# EAGLE schematic 電源基盤 (EAGLE 9.6.2)
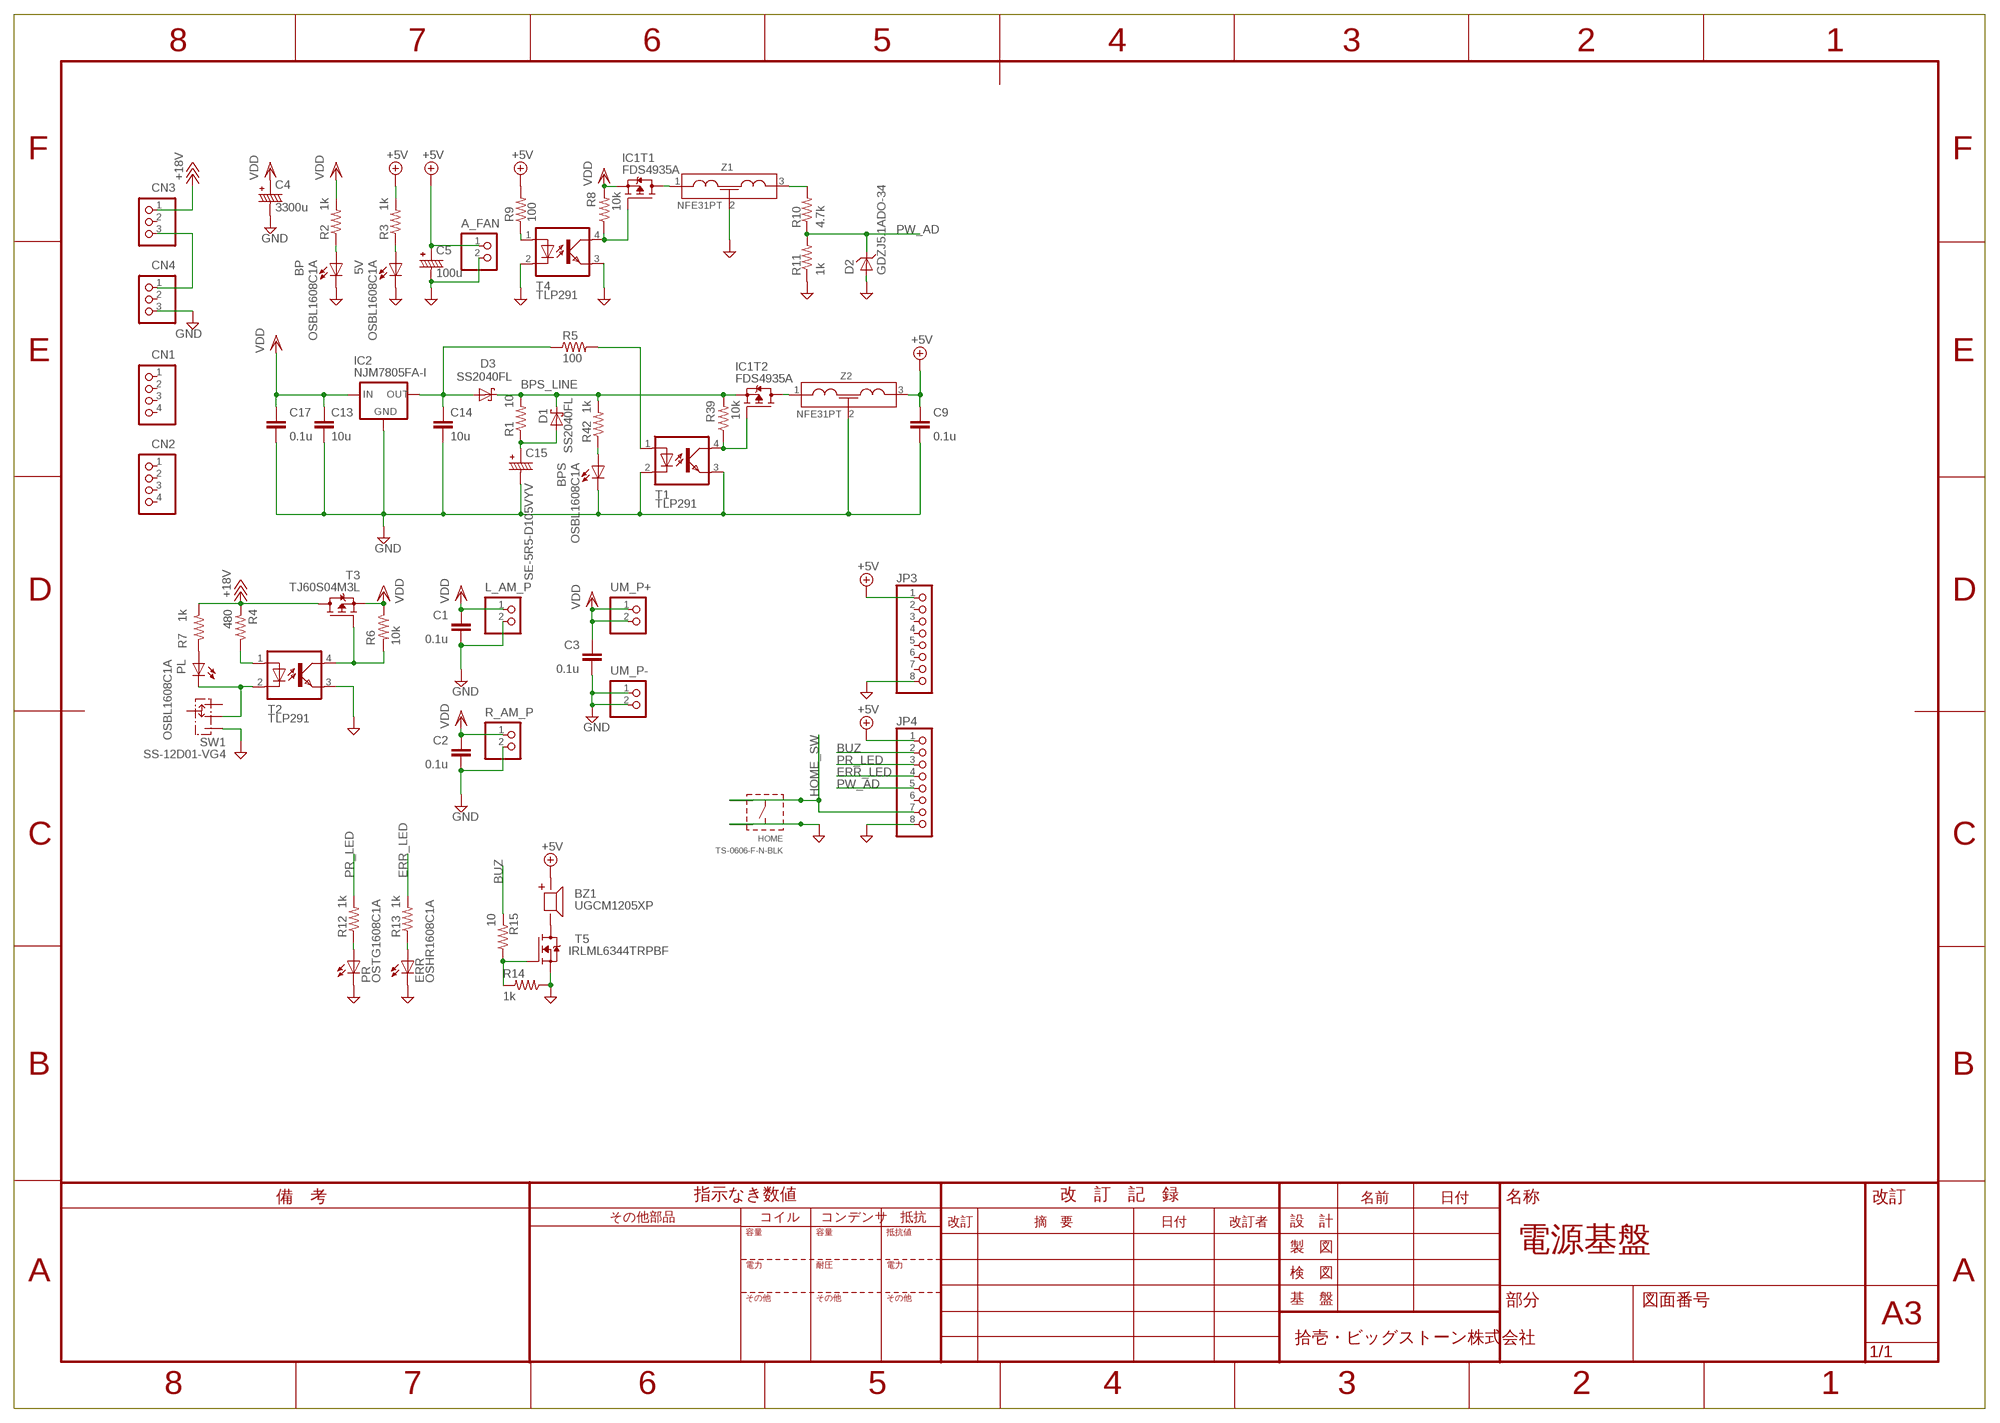
[diagram p0: schematic, sheet 1]

## Parts
5V  OSBL1608C1A  [LEDC1608X39N_B]
A_FAN  B2B-XH-A  [B2B-XH-A]
BP  OSBL1608C1A  [LEDC1608X39N_B]
BPS  OSBL1608C1A  [LEDC1608X39N_B]
BZ1  UGCM1205XP  [UGCM1205XP]
C1  0.1u  C-EUC0603  [C0603]
C2  0.1u  C-EUC0603  [C0603]
C3  0.1u  C-EUC0603  [C0603]
C4  3300u  35WXA3300MEFC18X25  [D18_L25_P7.5_D1]
C5  100u  16MH7100MEFC6.3X7  [CPOL6.3-7_2.5]
C9  0.1u  C-EUC0603  [C0603]
C13  10u  C2012  [C0805]
C14  10u  C2012  [C0805]
C15  SE-5R5-D105VYV  [SE-5R5-D105VYV]
C17  0.1u  C-EUC0603  [C0603]
CN1  B4B-XH-A  [B4B-XH-A]
CN2  B4B-XH-A  [B4B-XH-A]
CN3  B3P-VH  [B3P-VH]
CN4  B3P-VH  [B3P-VH]
D1  SS2040FL  [SOD-123]
D2  GDZJ5.1ADO-34  [DIOAD590W50L290D210B]
D3  SS2040FL  [SOD-123]
ERR  OSHR1608C1A  [LEDC1608X39N_R]
HOME  TS-0606-F-N-BLK  [TS-0606-F-N]
IC1  FDS4935A  [SOIC127P600X250-8N]
IC2  NJM7805FA-I  [TO220]
JP3  PINHD-1X8  [1X08]
JP4  PINHD-1X8  [1X08]
L_AM_P  B2P-VH  [B2P-VH]
PL  OSBL1608C1A  [LEDC1608X39N_B]
PR  OSTG1608C1A  [LEDC1608X39N_G]
R1  10  R-US_R0603  [R0603]
R2  1k  R-US_R0603  [R0603]
R3  1k  R-US_R0603  [R0603]
R4  480  R-US_R0603  [R0603]
R5  100  R-US_R0603  [R0603]
R6  10k  R-US_R0603  [R0603]
R7  1k  R-US_R0603  [R0603]
R8  10k  R-US_R0603  [R0603]
R9  100  R-US_R0603  [R0603]
R10  4.7k  R-US_R0603  [R0603]
R11  1k  R-US_R0603  [R0603]
R12  1k  R-US_R0603  [R0603]
R13  1k  R-US_R0603  [R0603]
R14  1k  R-US_R0603  [R0603]
R15  10  R-US_R0603  [R0603]
R39  10k  R-US_R0603  [R0603]
R42  1k  R-US_R0603  [R0603]
R_AM_P  B2P-VH  [B2P-VH]
SW1  SS-12D01-VG4  [SS-12D01-VG4]
T1  TLP291  [SOIC127P700X210-4N]
T2  TLP291  [SOIC127P700X210-4N]
T3  TJ60S04M3L  [DPACK]
T4  TLP291  [SOIC127P700X210-4N]
T5  IRLML6344TRPBF  [SOT95P240X110-3N]
UM_P+  B2P-VH  [B2P-VH]
UM_P-  B2P-VH  [B2P-VH]
Z1  NFE31PT  [NFE31]
Z2  NFE31PT  [NFE31]

## Nets
5V1 [power]: IC1.7(T2:D) IC1.8(T2:D) Z2.1
+5V: A_FAN.1 BZ1.+ C5.+ C9.1 JP3.1 JP4.1 R3.2 R9.2 Z2.3
+18V [power]: CN3.1 R4.2 R7.2 T3.2(D)
BLINE2 [power]: CN3.3 CN4.1
BPS_LINE [power]: D1.1(C) D3.1(C) IC1.1(T2:S) R1.2 R39.2 R42.2
BPS_OR [power]: C15.+ D1.2(A) R1.1
BUZ: JP4.2 R15.2
ERR_LED: JP4.3 R13.2
GND: 5V.2(C) A_FAN.2 BP.2(C) BPS.2(C) C1.2 C2.2 C3.2 C4.- C5.- C9.2 C13.2 C14.2 C15.- C17.2 CN4.3 D2.2(A) ERR.2(C) HOME.T3 HOME.T4 IC2.2(GND) JP3.8 JP4.8 L_AM_P.2 PR.K(C) R11.1 R14.1 R_AM_P.2 SW1.NO T1.2(C) T1.3(EMIT) T2.3(EMIT) T4.2(C) T4.3(EMIT) T5.2(S) UM_P-.1 UM_P-.2 Z1.2 Z2.2
HOME_SW: HOME.T1 HOME.T2 JP4.7
N$1: PL.1(A) R7.1
N$2: BP.1(A) R2.1
N$3: 5V.1(A) R3.1
N$4: IC1.5(T1:D) IC1.6(T1:D) Z1.1
N$5 [power]: C14.1 D3.2(A) IC2.3(OUT) R5.1
N$6: R4.1 T2.1(A)
N$7: PL.2(C) SW1.COM T2.2(C)
N$8: R6.2 T2.4(COL) T3.1(G)
N$9: IC1.4(T1:G) R8.1 T4.4(COL)
N$10: PR.A R12.1
N$11: R9.1 T4.1(A)
N$12: R10.2 Z1.3
N$13: IC1.2(T2:G) R39.1 T1.4(COL)
N$14: ERR.1(A) R13.1
N$15: BZ1.- T5.3(D)
N$16: R14.2 R15.1 T5.1(G)
N$17: R5.2 T1.1(A)
N$47: BPS.1(A) R42.1
PR_LED: JP4.4 R12.2
PW_AD: D2.1(C) JP4.5 R10.1 R11.2
VDD [power]: C1.1 C2.1 C3.1 C4.+ C13.1 C17.1 IC1.3(T1:S) IC2.1(IN) L_AM_P.1 R2.2 R6.1 R8.2 R_AM_P.1 T3.3(S) UM_P+.1 UM_P+.2
Unconnected: CN1.1 CN1.2 CN1.3 CN1.4 CN2.1 CN2.2 CN2.3 CN2.4 CN3.2 CN4.2 JP3.2 JP3.3 JP3.4 JP3.5 JP3.6 JP3.7 JP4.6 SW1.NC

## Library data of the parts
5V BP BPS PL = LED:OSBL1608C1A: 青色チップＬＥＤ ［１６０８］ ＯＳＢＬ１６０８ （２０個入） [OSBL1608C1A] 通販コード I-03982 発売日 2010/07/14 定格(Ta=25℃時) ◆VF：2.9V(IF=5mA) ◆最大電流：30mA ◆輝度1：23mcd(IF=5mA) ◆輝度2：70mcd(IF=20mA) ◆波長：470nm(青色) ◆サイズ：1608 (横1.6x縦0.8x厚さ0.6mm) ◆逆耐圧：5V ◆PD：100mW ■カラーバリエーション 白色I-03986 </catalog/g/gI-03986/> 赤色I-03978 </catalog/g/gI-03978/> 緑色I-06417 </catalog/g/gI-06417/> 青色I-03982 </catalog/g/gI-03982/> 黄色I-03984橙色I-06416 </catalog/g/gI-06416/> 黄緑色I-03980 </catalog/g/gI-03980/> ウォームホワイト色I-09640 </catalog/g/gI-09640> </catalog/g/gI-03984/> ◆販売単位：20個カットテーピング ※4000個単位のリール(I-03983 </catalog/g/gI-03983/>)もございます。 [I-03982] 青色チップＬＥＤ ［１６０８］ ＯＳＢＬ１６０８ （２０個入） </catalog/faq/faq.aspx#10020> 1パック ￥200（税込）
A_FAN = jst-xh:B2B-XH-A: Wire-to-Board 2.5mm pitch top mount connector Source: http://www.jst-mfg.com/product/pdf/jpn/XH.pdf http://www.jst-mfg.com/product/detail.php?series=277
BZ1 = UGCM1205XP:UGCM1205XP
C1-C3 C9 C17 = rcl:C-EU: CAPACITOR, European symbol; SPICEPREFIX: C
C4 = 小形アルミニウム電解コンデンサ_WXAシリーズ:35WXA3300MEFC18X25
C5 = 小形アルミニウム電解コンデンサ_MH7シリーズ:16MH7100MEFC6.3X7
C13 C14 = rcl:C: CAPACITOR, European symbol; SPICEPREFIX: C
C15 = スーパーキャパシタ:SE-5R5-D105VYV: 電気二重層コンデンサー１Ｆ５．５Ｖ（薄型） [SE-5R5-D105VYV] 通販コード P-04249 発売日 2010/11/21 メーカーカテゴリ KAMCAP </catalog/goods/search.aspx?maker=KAM&style=T&search.x=true> コイン型の電気二重層コンデンサです。 リアルタイムクロックのバックアップ電源等に最適です。 縦置き型(立型)ですので、基板の実装面積の縮小が可能です。 適度な内部抵抗を持ち、特別な回路なしで簡単に使えます。 耐圧が5V以上あり、一般的デジタル回路に簡単に使えま※極性は本体の端子の刻印で判別できます。 主な仕様 ・容量：1.0F(=1,000,000μF) ・容量誤差：+10%~+30% ・耐圧：5.5V ・最大等価直列抵抗(ESR)：10Ω(@1kHz) ・動作温度範囲：-25℃~70℃ 寸法 ・直径：18.5mm ・厚さ：4.0mm ・ピン間：約5.0mm [P-04249] 電気二重層コンデンサー１Ｆ５．５Ｖ（薄型） 1個 ￥100（税込）
CN1 CN2 = jst-xh:B4B-XH-A: Wire-to-Board 2.5mm pitch top mount connector Source: http://www.jst-mfg.com/product/pdf/jpn/XH.pdf http://www.jst-mfg.com/product/detail.php?series=277
CN3 CN4 = jst-vh:B3P-VH: Wire-to-Board 3.96mm pitch top mount connector Source: http://www.jst-mfg.com/product/pdf/jpn/VH.pdf http://www.jst-mfg.com/product/detail.php?series=262
D1 D3 = PI_ダイオード:SS2040FL: 表面実装用ショットキーバリアダイオード（４０Ｖ２Ａ）ＳＳ２０４０ＦＬ（２０個入） [SS2040FL] 通販コード I-02073 発売日 2007/10/24 メーカーカテゴリ PANJIT INTERNATIONAL INC.(パンジット) </catalog/goods/search.aspx?maker=panjit&style=T&search.x=true> 表面実装タイプのショットキー・バリア・ダイオードです。 ■主な仕様 ・種類：ショットキーバリア ・回路数：1 ・逆電圧：40V ・平均順電流：2.0A ・ピーク順電流：50A ・順電圧：0.45V ・端子間容量：70pF ・パッケージ：SOD-123FL 3000個単位(リール売り)は→I-02074 </catalog/g/gI-02074/> [I-02073] 表面実装用ショットキーバリアダイオード（４０Ｖ２Ａ）ＳＳ２０４０ＦＬ（２０個入） </catalog/faq/faq.aspx#10020> 1パック ￥300（税込）
D2 = ダイオード:GDZJ5.1A: ツェナーダイオード（５．１Ｖ５００ｍＷ） ＧＤＺＪ５．１Ａ [GDZJ5.1A] 通販コード I-07493 発売日 2014/03/12 メーカーカテゴリ PANJIT INTERNATIONAL INC.(パンジット) PANJIT社のツェナー(定電圧)ダイオードです。 ■主な仕様 ・種類：ツェナーダイオード ・回路数：1 ・許容損失：500mW ・ツェナー電圧：5.1V ・パッケージ：DO-34 GDZJシリーズ PDFデータシート 1本 ￥10（税込）
ERR = LED:OSHR1608C1A: 赤色チップＬＥＤ ［１６０８］ ＯＳＨＲ１６０８ （２０個入） [OSHR1608C1A] 通販コード I-03978 発売日 2010/07/14 メーカーカテゴリ OptoSupply </catalog/goods/search.aspx?maker=optosupp&style=T&search.x=true> 定格(Ta=25℃) ◆VF：1.9V(IF=5mA) ◆最大電流：30mA ◆輝度1：35mcd(IF=5mA) ◆輝度2：140mcd(IF=25mA) ◆最大消費電力：70mW ◆波長：625nm(赤色) ◆サイズ：1608 (横1.6x縦0.8厚0.4mm) ◆逆耐圧：5V ◆PD：70mW ■カラーバリエーション 白色I-03986 </catalog/g/gI-03986/> 赤色I-03978 </catalog/g/gI-03978/> 緑色I-06417 </catalog/g/gI-06417/> 青色I-03982 </catalog/g/gI-03982/> 黄色I-03984橙色I-06416 </catalog/g/gI-06416/> 黄緑色I-03980 </catalog/g/gI-03980/> ウォームホワイト色I-09640 </catalog/g/gI-09640> </catalog/g/gI-03984/> ※4000個単位のリール(I-03979 </catalog/g/gI-03979/>)もございます。 [I-03978] 赤色チップＬＥＤ ［１６０８］ ＯＳＨＲ１６０８ （２０個入） 1パック ￥200（税込）
HOME = タクトスイッチ:TS-0606-F-N-BLK: タクトスイッチ（黒色） [TS-0606-F-N-BLK] 通販コード P-03647 発売日 2010/04/01 メーカーカテゴリ Cosland Co,. Ltd. </catalog/goods/search.aspx?maker=cosland&style=T&search.x=true> 基板取付用のタクトスイッチ(押しボタンスイッチ)です。2.54mmピッチの基板に使用できます。 ※入荷時期により色あい、細かいデザインや形が微妙に変わることがあります、ご了承ください。 ■主な仕様 ・種別：タクトスイッチ ・表記：A接点 ・回路数：1回路 ・接点：1接点 ・定格印加電圧：30VDC ・定格開閉電圧：12VDC ・定格開閉電流：50mA ・定格通電電流：300mA ・定格開閉皮相電力：9W ・接触抵抗：100mΩ以下 ・動作：モーメンタリ ・取付タイプ：基板取付 ・電気的接続：スルーホール実装 ・色：黒 ・ピン数：4 TS-0606シリーズ PDFデータシート </download/ds/cosland/ts-0606_20200714.pdf> TS-0606シリーズ一覧 </catalog/goods/search.aspx?keyword=&maker=&goods=&number=TS-0606-F-N&name=&min_price=&max_price=&last_sdt=&sort=&style=T&search.x=0&search.y=0> ● この商品のよくある質問（Ｑ＆Ａ） </catalog/faq/goodsfaq.aspx?goods=P-03647>が1件あります。商品選定・製作の参考にしてください。 関連商品≫組立ｷｯﾄ </catalog/c/ckit_dT> / ﾌﾞﾚｯﾄﾞﾎﾞｰﾄﾞ </catalog/c/cbread> / ﾏｲｺﾝ </catalog/c/cmicon_dT>(PIC </catalog/c/cpicr> H8 </catalog/c/ch8> RX </catalog/c/crx>) / USB </catalog/c/cusb> / TR </catalog/c/ctr>(TO-220 </catalog/c/cto-220> TO-92 </catalog/c/cto-92> TO-3P </catalog/c/cto-3p> SMD </catalog/c/cctr>) / FET </catalog/c/cfet>(Nch </catalog/c/c2sk> Pch </catalog/c/c2sj> SMD </catalog/c/ccfet> TO-252 </catalog/goods/search.aspx?keyword=fet+dpak&goods=i&search=x> SOT-23 </catalog/goods/search.aspx?keyword=sot23&goods=i&name=fet&search=x>) / ﾀﾞｲｵｰﾄﾞ </catalog/c/cdiode>(整流 </catalog/c/csilicon> ｼｮｯﾄｷｰ </catalog/c/cschottky> ﾌﾞﾘｯｼﾞ </catalog/c/cbridge> SMD </catalog/c/csmddiode> CRD </catalog/c/ccrd> ﾂｪﾅ </catalog/c/czd>) / 抵抗 </catalog/c/cregister>(ｶｰﾎﾞﾝ </catalog/goods/search.aspx?keyword=%83J%81%5B%83%7B%83%93&search=x> 金皮 </catalog/goods/search.aspx?keyword=%8B%E0%91%AE%94%E7%96%8C&image=%8C%9F%8D%F5&search=x> 電力 </catalog/c/cregi7> SMD </catalog/c/cchipreg>) / ｲﾝﾀﾞｸﾀ </catalog/c/ccoil> / ｺﾝﾃﾞﾝｻ </catalog/c/ccap>(電解 </catalog/c/cchemicon> 積ｾﾗ </catalog/c/ccap3> ﾁｯﾌﾟ積ｾﾗ </catalog/c/ccap8> 電気二重層 </catalog/c/ccap2>) / LED </catalog/c/cled_dT>(3mm </catalog/c/c3mm> 5mm </catalog/c/c5mm> 角型 </catalog/c/csuperflx> SMD </catalog/c/csmdled> 点滅 </catalog/c/cblanking> ﾊﾟﾜｰ </catalog/c/cpwrled> ﾊﾞｰ </catalog/c/cbar> ７ｾｸﾞ </catalog/c/ca7seg>) / LCD </catalog/c/cclcd> / ACｱﾀﾞﾌﾟﾀ </catalog/c/cswpower> / VR </catalog/c/cvr> / SW </catalog/c/csw>(ﾀｸﾄ </catalog/c/ctactsw> ﾄｸﾞﾙ </catalog/c/ctoggle> 押ﾎﾞﾀﾝ </catalog/c/cpushsw> 自照式 </catalog/c/csw8> ﾛｰﾀﾘ </catalog/c/crotarysw> ｽﾗｲﾄﾞ </catalog/c/cslidesw>) / ｹｰｽ </catalog/c/ccase> / 基板 </catalog/c/cboard>(ﾕﾆﾊﾞｰｻﾙ </catalog/c/cuboard> SMD </catalog/c/csuboard> DIP化 </catalog/c/cwithbrd> 変換 </catalog/c/ccpcb> 電力 </catalog/c/cboard11> ｱﾙﾐ </catalog/c/calumi>) / ﾋﾟﾝﾍｯﾀﾞ </catalog/c/cheader> / ﾋﾟﾝｿｹｯﾄ </catalog/c/cframe> / 線材 </catalog/c/csen4> / ﾀｰﾐﾅﾙ </catalog/c/cterminal> / ｺﾈｸﾀ </catalog/c/cconn> / 電池ｹｰｽ </catalog/c/cbattca> / 電池一般 </catalog/c/cbatt_dT>(鉛蓄電池 </catalog/c/cbatpb> ｱﾙｶﾘ </catalog/e/ealkarine> ﾎﾞﾀﾝ･ｺｲﾝ </catalog/c/cbatcoin>) / 放熱器 </catalog/c/cheat> / ﾊﾟｰﾂ </catalog/c/cparts_dT> [P-03647] タクトスイッチ（黒色） </catalog/faq/faq.aspx#10020> 1個 ￥10（税込）
IC1 = FET:FDS4935A
IC2 = 正三端子レギュレータ:NJM7805FA: 三端子レギュレーター ５Ｖ１．５Ａ ＮＪＭ７８０５ＦＡ [NJM7805FA] 通販コード I-08678 発売日 2014/11/05 メーカーカテゴリ 新日本無線株式会社(New JRC) </catalog/goods/search.aspx?maker=jrc&style=T&search.x=true> 7805は定番の5V用三端子レギュレーターICです。様々な回路の電源電圧の安定化に使われています。入力側、出力側にコンデンサーをそれぞれ並列に接続して使用します。 ■主な仕様 ・出力方式：シリーズ ・出力正負：正電源 ・入力電圧：～35V ・出力電圧：5V ・最大出力電流：1.5A ・許容損失：16W ・リップル除去比(PSRR)：78dB ・パッケージ：TO-220 NJM78 PDFデータシート </download/ds/njr/NJM7800_J.pdf> 7805の検索結果 </catalog/goods/search.aspx?search=x&keyword=7805> 3端子レギュレータ一覧 </catalog/c/c3pinreg/> 放熱器(ヒートシンク)一覧 </catalog/c/cheatsink/> 定電圧電源IC一覧 </catalog/c/cregic2_dT> 関連商品≫DCDC </catalog/c/cdcdc> / 電源･電力ｷｯﾄ </catalog/c/cpowerkit> / 電源IC </catalog/c/cpoweric> / LED </catalog/c/cled_dT>(3mm </catalog/c/c3mm> 5mm </catalog/c/c5mm> 角型 </catalog/c/csuperflx> SMD </catalog/c/csmdled> ﾊﾟﾜｰ </catalog/c/cpwrled> ７ｾｸﾞ </catalog/c/ca7seg>) / ﾄﾞﾗｲﾊﾞIC </catalog/c/cdriveric> / OPAMP </catalog/c/copamp> / TR </catalog/c/ctr>(NPN </catalog/c/cnpn> PNP </catalog/c/cpnp> SMD </catalog/c/cctr>) / FET </catalog/c/cfet>(Nch </catalog/c/c2sk> Pch </catalog/c/c2sj> SMD </catalog/c/ccfet>) / ﾀﾞｲｵｰﾄﾞ </catalog/c/cdiode> / ｺﾝﾃﾞﾝｻ </catalog/c/ccap> / 基板 </catalog/c/cboard>(SMD </catalog/c/csuboard> DIP化 </catalog/c/cwithbrd> 電力 </catalog/c/cboard11>) / ﾋﾟﾝﾍｯﾀﾞ </catalog/c/cheader> / ﾋﾟﾝｿｹｯﾄ </catalog/c/cframe> / 線材 </catalog/c/csen4> / ﾀｰﾐﾅﾙ </catalog/c/cterminal> / ｺﾈｸﾀ </catalog/c/cconn> / 電池ｹｰｽ </catalog/c/cbattca> / 放熱器 </catalog/c/cheatsink> / ﾈｼﾞ </catalog/c/cscrew> / 抵抗 </catalog/c/cregister> / ﾘﾚｰ </catalog/c/crelay> / ﾌﾞﾚｯﾄﾞﾎﾞｰﾄﾞ </catalog/c/cbread> / 電池一般 </catalog/c/cbatt_dT> / ACｱﾀﾞﾌﾟﾀ </catalog/c/cswpower> / DCｼﾞｬｯｸ </catalog/c/cdcj> / 工作用品 </catalog/c/ckosaku_dT> / ﾊﾟｰﾂ </catalog/c/cparts_dT> [I-08678] 三端子レギュレーター ５Ｖ１．５Ａ ＮＪＭ７８０５ＦＡ </catalog/faq/faq.aspx#10020> 1個 ￥40（税込） 5個以上 (単価) ￥38（税込） 合計￥190（税込）
JP3 JP4 = pinhead:PINHD-1X8: PIN HEADER
L_AM_P R_AM_P UM_P+ UM_P- = jst-vh:B2P-VH: Wire-to-Board 3.96mm pitch top mount connector Source: http://www.jst-mfg.com/product/pdf/jpn/VH.pdf http://www.jst-mfg.com/product/detail.php?series=262
PR = LED:OSTG1608C1A: 緑色チップＬＥＤ ［１６０８］ ＯＳＴＧ１６０８Ｃ１Ａ （２０個入） [OSTG1608C1A] 通販コード I-06417 発売日 2013/03/26 ・標準電流：5mA ◆絶対最大定格(Ta=25℃) ・VR：5V ・PD：100mW ◆電気光学特性(IF=5mA、Ta=25℃、Typ.) ・VF：2.9V ・IV：103mcd D：525nm ・2θ1/2：120° ■カラーバリエーション 白色I-03986 </catalog/g/gI-03986/> 赤色I-03978 </catalog/g/gI-03978/> 緑色I-06417 </catalog/g/gI-06417/> 青色I-03982 </catalog/g/gI-03982/> 黄色I-03984 </catalog/g/gI-03984/> 橙色I-06416 </catalog/g/gI-06416/> 黄緑色I-03980 </catalog/g/gI-03980/> ウォームホワイト色I-09640 </catalog/g/gI-09640> [I-06417] 緑色チップＬＥＤ ［１６０８］ ＯＳＴＧ１６０８Ｃ１Ａ （２０個入） 1パック ￥250（税込）
R1-R15 R39 R42 = rcl:R-US_: RESISTOR, American symbol; SPICEPREFIX: R
SW1 = スライドスイッチ:SS-12D01-VG4: 基板用スライドスイッチ ＳＳ－１２Ｄ０１－ＶＧ４ [SS-12D01-VG4] 通販コード P-08791 発売日 2015/01/20 メーカーカテゴリ Zhejiang Jianfu Electronics Co., Ltd </catalog/goods/search.aspx?maker=jianfu&style=T&search.x=true> ■基板取付用小型スライドスイッチ 両端に補助ガイドがついています。 ■主な仕様 ・種別：スライドスイッチ ・表記：ON-ON ・回路数：1回路 ・接点：1接点 ・定格開閉電圧：50VDC ・定格開閉電流：0.5A ・接触抵抗：30mΩ ・取付タイプ：基板取付 ・電気的接続：スルーホール実装 ・ピン数：5 SS-12D01 PDFデータシート </download/ds/jianfu/SS-12D01-VG4.pdf> タクトスイッチ各種 </catalog/c/ctactsw> トグルスイッチ各種 </catalog/c/ctoggle> スイッチ各種 </catalog/c/csw> 関連商品≫基板 </catalog/c/cboard>(ﾕﾆﾊﾞｰｻﾙ </catalog/c/cuboard> SMD </catalog/c/csuboard> DIP化 </catalog/c/cwithbrd> 変換 </catalog/c/ccpcb> 電力 </catalog/c/cboard11> ｱﾙﾐ </catalog/c/calumi>) / ﾌﾞﾚｯﾄﾞﾎﾞｰﾄﾞ </catalog/c/cbread> / ﾏｲｺﾝ </catalog/c/cmicon_dT>(PIC </catalog/c/cpicr> H8 </catalog/c/ch8> RX </catalog/c/crx>) / TR </catalog/c/ctr>(TO-3P </catalog/c/cto-3p> TO-220 </catalog/c/cto-220> TO-92 </catalog/c/cto-92> SMD </catalog/c/cctr>) / FET </catalog/c/cfet>(Nch </catalog/c/c2sk> Pch </catalog/c/c2sj> SMD </catalog/c/ccfet>) / LED </catalog/c/cled_dT>(3mm </catalog/c/c3mm> 5mm </catalog/c/c5mm> 角型 </catalog/c/csuperflx> SMD </catalog/c/csmdled> 点滅 </catalog/c/cblanking> ﾊﾟﾜｰ </catalog/c/cpwrled> ﾊﾞｰ </catalog/c/cbar> ７ｾｸﾞ </catalog/c/ca7seg>) / ｺﾝﾃﾞﾝｻ </catalog/c/ccap> / ﾀﾞｲｵｰﾄﾞ </catalog/c/cdiode> / 抵抗 </catalog/c/cregister> / VR </catalog/c/cvr> / 電源IC </catalog/c/cpoweric> / ﾘﾚｰ </catalog/c/crelay> / ACｱﾀﾞﾌﾟﾀ </catalog/c/cswpower> / ﾋﾟﾝﾍｯﾀﾞ </catalog/c/cheader> / ﾋﾟﾝｿｹｯﾄ </catalog/c/cframe> / 線材 </catalog/c/csen4> / ﾀｰﾐﾅﾙ </catalog/c/cterminal> / ｺﾈｸﾀ </catalog/c/cconn> / 電池ｹｰｽ </catalog/c/cbattca> / 放熱器 </catalog/c/cheatsink> / 電池一般 </catalog/c/cbatt_dT> / 工作用品 </catalog/c/ckosaku_dT> [P-08791] 基板用スライドスイッチ ＳＳ－１２Ｄ０１－ＶＧ４ </catalog/faq/faq.aspx#10020> </catalog/faq/faq.aspx#10020> 1個 ￥30（税込）
T1 T2 T4 = フォトカプラ:TLP291: フォトカプラ 赤外ＬＥＤ＋フォトトランジスタ ＴＬＰ２９１（ＧＢ） （１０個入） [TLP291(GB-TPE] 通販コード I-16070 発売日 2013/12/05 メーカーカテゴリ 株式会社東芝セミコンダクター社(TOSHIBA) </catalog/goods/search.aspx?maker=toshiba&style=T&search.x=true> 東芝の1回路入りフォトカプラ、GBランク品です。 ■用途 ・電源 ・プログラマブルコントローラ ・ハイブリッドIC ■主な仕様 ・回路数：1回路 ・絶縁耐圧：～3750V ・入力方式：片方向 ・出力方式：フォトトランジスタ ・2次耐圧：～80V ・出力電流：～50mA ・伝搬遅延H/L：7μs ・伝搬遅延L/H：7μs ・立ち上がり時間：4μs ・立ち下がり時間：7μs ・1次順電圧：1.25V ・1次順電流：～50mA ・変換効率：100～400% ・動作温度：-55～+110℃ ・実装タイプ：表面実装 ・パッケージ：SO4 ※1個単位の少量販売もございます⇒I-07189 </catalog/g/gI-07189/> ※8ch(8ビット)対応TLP291(GB)実装済みモジュールもございます⇒I-08029 </catalog/g/gI-08029/> ※ピッチ変換ＤＩＰ化基板 ⇒ P-16053 </catalog/g/gP-16053/>
T3 = 東芝_PchMOSFET:TJ60S04M3L
T5 = FET:IRLML6344TRPBF: ＮｃｈＭＯＳＦＥＴ ＩＲＬＭＬ６３４４ＴＲＰＢＦＴＲ （１０個入） [IRLML6344TRPBFTR] 通販コード I-06049 発売日 2012/07/18 メーカーカテゴリ International Rectifier </catalog/goods/search.aspx?maker=ir&style=T&search.x=true> ◆特徴 ・IR社チップMOSFET ・低オン抵抗29mΩ ・SOT23パッケージ ・Nチャンネル ■主な仕様 ・構造：MOSFET ・回路数：1 ・チャネル：N ・ドレイン・ソース間電圧：30V ・ゲート・ソース間電圧：±12V ・ドレイン電流(DC)：5.0A ・ドレイン・ソース間オン抵抗：22mΩ ・許容損失(25℃)：1.3W ・パッケージ：SOT-23 ※DIP化基板⇒P-03659 </catalog/g/gP-03659> P-11966 </catalog/g/gP-11966> [I-06049] ＮｃｈＭＯＳＦＥＴ ＩＲＬＭＬ６３４４ＴＲＰＢＦＴＲ （１０個入） 1パック ￥240（税込）
Z1 Z2 = EMIフィルタ:NFE31PT: ＥＭＩフィルタ（ムラタエミフィル）ＬＣ複合タイプ２２００ｐＦ（１０個入） [NFE31PT222Z1E9] 通販コード P-05497 発売日 2012/09/20 メーカーカテゴリ 株式会社村田製作所(muRata) </catalog/goods/search.aspx?maker=murata&style=T&search.x=true> チップ3端子コンデンサ(フィールドスルーコンデンサ/貫通コンデンサ/EMIフィルタ/エミフィル)は、ノイズ対策用に開発された3端子コンデンサをチップ形状にしたもので、内部が貫通コンデンサのように構成されており、グランド側のインピーダンスが極めて小さくなるように設計されています。 この構造により、数百MHz以上の高周波領域のノイズ除去効果にすぐれています。 NFEシリーズの特長 ■大電流に対応、貫通コンデンサで高周波対応 ■電源ラインのノイズ対策、低インピーダンスラインのノイズ対策 主な仕様 ・静電容量：2200pF±50% ・定格電流：6A ・耐圧：25Vdc ・絶縁抵抗：1000MΩ以上 ・使用温度範囲：-40~+85℃ 1パック ￥250（税込）

## Net classes
1 power: clearance 0.381 mm